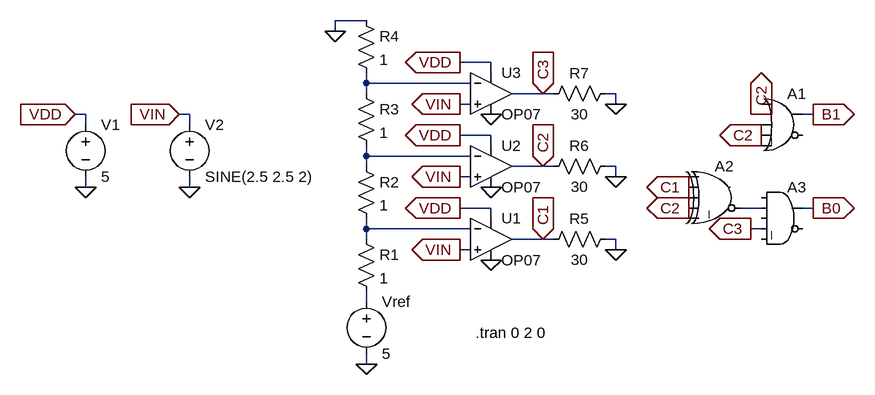
[diagram p0: schematic 2bit_ADC.asc]
2bit_ADC.asc, the LTspice schematic file:
Version 4.1
SHEET 1 1928 756
WIRE 544 -32 496 -32
WIRE 496 -16 496 -32
WIRE 736 32 688 32
WIRE 736 48 736 32
WIRE 544 64 544 48
WIRE 704 64 544 64
WIRE 544 80 544 64
WIRE 816 80 768 80
WIRE 832 80 816 80
WIRE 928 80 912 80
WIRE 704 96 688 96
WIRE 928 96 928 80
WIRE 112 112 96 112
WIRE 272 112 256 112
WIRE 1232 112 1216 112
WIRE 112 128 112 112
WIRE 272 128 272 112
WIRE 736 144 688 144
WIRE 736 160 736 144
WIRE 544 176 544 160
WIRE 704 176 544 176
WIRE 544 192 544 176
WIRE 816 192 768 192
WIRE 832 192 816 192
WIRE 928 192 912 192
WIRE 704 208 688 208
WIRE 928 208 928 192
WIRE 112 224 112 208
WIRE 272 224 272 208
WIRE 736 256 688 256
WIRE 1152 256 1120 256
WIRE 1232 256 1216 256
WIRE 736 272 736 256
WIRE 544 288 544 272
WIRE 704 288 544 288
WIRE 1152 288 1136 288
WIRE 544 304 544 288
WIRE 816 304 768 304
WIRE 832 304 816 304
WIRE 928 304 912 304
WIRE 704 320 688 320
WIRE 928 320 928 304
WIRE 544 400 544 384
WIRE 544 496 544 480
FLAG 96 112 VDD
IOPIN 96 112 In
FLAG 112 224 0
FLAG 256 112 VIN
IOPIN 256 112 In
FLAG 272 224 0
FLAG 544 496 0
FLAG 736 112 0
FLAG 736 224 0
FLAG 736 336 0
FLAG 496 -16 0
FLAG 688 320 VIN
IOPIN 688 320 Out
FLAG 688 208 VIN
IOPIN 688 208 Out
FLAG 688 96 VIN
IOPIN 688 96 Out
FLAG 688 32 VDD
IOPIN 688 32 Out
FLAG 688 144 VDD
IOPIN 688 144 Out
FLAG 688 256 VDD
IOPIN 688 256 Out
FLAG 1232 112 B1
IOPIN 1232 112 Out
FLAG 1232 256 B0
IOPIN 1232 256 Out
FLAG 928 96 0
FLAG 928 208 0
FLAG 928 320 0
FLAG 816 304 C1
IOPIN 816 304 In
FLAG 816 192 C2
IOPIN 816 192 In
FLAG 816 80 C3
IOPIN 816 80 In
FLAG 1152 112 C2
IOPIN 1152 112 Out
FLAG 1040 224 C1
IOPIN 1040 224 Out
FLAG 1040 256 C2
IOPIN 1040 256 Out
FLAG 1136 288 C3
IOPIN 1136 288 Out
FLAG 1152 144 C2
IOPIN 1152 144 Out
SYMBOL voltage 112 112 R0
WINDOW 123 0 0 Left 0
WINDOW 39 0 0 Left 0
SYMATTR InstName V1
SYMATTR Value 5
SYMBOL voltage 272 112 R0
WINDOW 123 0 0 Left 0
WINDOW 39 0 0 Left 0
SYMATTR InstName V2
SYMATTR Value SINE(2.5 2.5 2)
SYMBOL res 528 64 R0
SYMATTR InstName R3
SYMATTR Value 1
SYMBOL res 528 176 R0
SYMATTR InstName R2
SYMATTR Value 1
SYMBOL res 528 288 R0
SYMATTR InstName R1
SYMATTR Value 1
SYMBOL voltage 544 384 R0
WINDOW 123 0 0 Left 0
WINDOW 39 0 0 Left 0
SYMATTR InstName Vref
SYMATTR Value 5
SYMBOL OpAmps\\OP07 736 240 R0
SYMATTR InstName U1
SYMBOL OpAmps\\OP07 736 128 R0
SYMATTR InstName U2
SYMBOL OpAmps\\OP07 736 16 R0
SYMATTR InstName U3
SYMBOL res 528 -48 R0
SYMATTR InstName R4
SYMATTR Value 1
SYMBOL Digital\\or 1184 64 R0
SYMATTR InstName A1
SYMBOL Digital\\xor 1088 176 R0
SYMATTR InstName A2
SYMBOL res 816 320 R270
WINDOW 0 32 56 VTop 2
WINDOW 3 0 56 VBottom 2
SYMATTR InstName R5
SYMATTR Value 30
SYMBOL res 816 208 R270
WINDOW 0 32 56 VTop 2
WINDOW 3 0 56 VBottom 2
SYMATTR InstName R6
SYMATTR Value 30
SYMBOL res 816 96 R270
WINDOW 0 32 56 VTop 2
WINDOW 3 0 56 VBottom 2
SYMATTR InstName R7
SYMATTR Value 30
SYMBOL Digital\\and 1184 208 R0
SYMATTR InstName A3
TEXT 712 448 Left 2 !.tran 0 2 0

The netlist it stands for:
* 2bit_ADC.asc
V1 VDD 0 5
V2 VIN 0 SINE(2.5 2.5 2)
R3 N001 N002 1
R2 N002 N004 1
R1 N004 N005 1
Vref N005 0 5
X§U1 VIN N004 VDD 0 C1 LT1001  ; OP07, pins In+ In- V+ V- OUT
X§U2 VIN N002 VDD 0 C2 LT1001  ; OP07, pins In+ In- V+ V- OUT
X§U3 VIN N001 VDD 0 C3 LT1001  ; OP07, pins In+ In- V+ V- OUT
R4 0 N001 1
A1 0 C2 0 C2 0 0 B1 0 OR
A2 0 C1 0 C2 0 N003 0 0 XOR
R5 C1 0 30
R6 C2 0 30
R7 C3 0 30
A3 0 N003 0 C3 0 0 B0 0 AND
.tran 0 2 0
.lib LTC.lib
.backanno
.end